# EAGLE design servo (EAGLE 6.5.0)
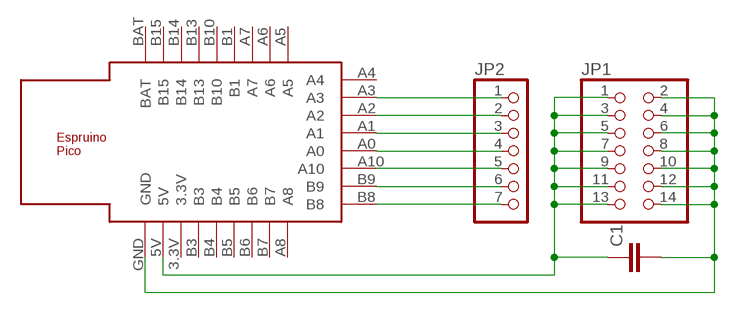
[diagram p0: schematic, sheet 1]

## Parts
C1  C-EUC1210  [C1210]
JP1  PINHD-2X7  [2X07]
JP2  PINHD-1X7  [1X07]
U$1  ESPRUINO_PICO_SMD  [ESPRUINO_PICO_SMD]

## Nets
5V: C1.1 JP1.1 JP1.3 JP1.5 JP1.7 JP1.9 JP1.11 JP1.13 U$1.5V
GND: C1.2 JP1.2 JP1.4 JP1.6 JP1.8 JP1.10 JP1.12 JP1.14 U$1.GND
N$1: JP2.1 U$1.A3
N$2: JP2.2 U$1.A2
N$3: JP2.3 U$1.A1
N$4: JP2.4 U$1.A0
N$5: JP2.5 U$1.A10
N$6: JP2.6 U$1.B9
N$9: JP2.7 U$1.B8
Unconnected: U$1.3.3V U$1.A4 U$1.A5 U$1.A6 U$1.A7 U$1.A8 U$1.B1 U$1.B3 U$1.B4 U$1.B5 U$1.B6 U$1.B7 U$1.B10 U$1.B13 U$1.B14 U$1.B15 U$1.BAT

## Library data of the parts
C1 = rcl:C-EU: CAPACITOR, European symbol
JP1 = pinhead:PINHD-2X7: PIN HEADER
JP2 = pinhead:PINHD-1X7: PIN HEADER
U$1 = espruino_pico:ESPRUINO_PICO_SMD

## Net classes
0 default: width 0.305 mm

## Board
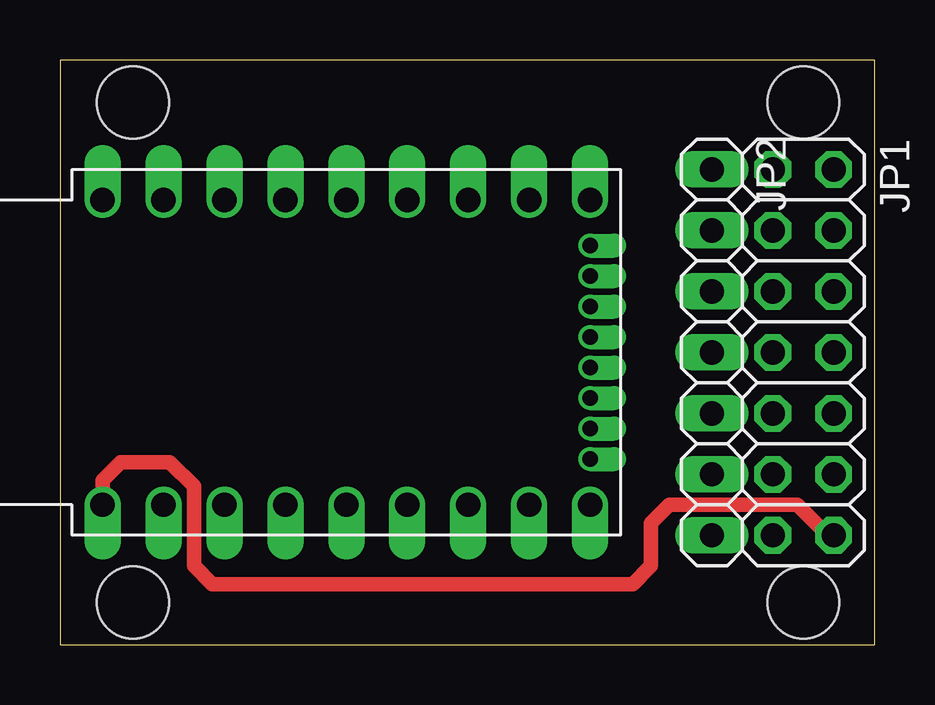
[diagram p1: board, top side]
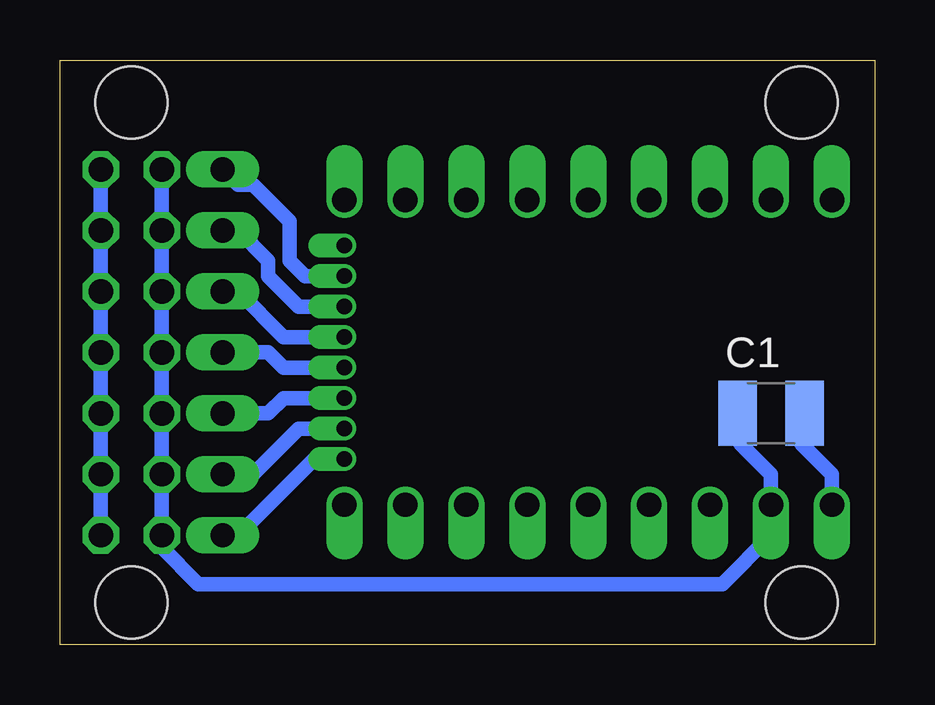
[diagram p2: board, bottom side, seen from below]

Size 33.96 x 24.37 mm. Coordinates in mm from the lower left corner, seen from the top.
Outline: 0,0 33.96,0 33.96,24.37 0,24.37 0,0
Copper layers (1*16): Top 0.0356mm / dielectric 1.5011mm / Bottom 0.0356mm
Design rules "oshpark": minimum track width 10mil, minimum drill 13mil, track to track 8mil, track to pad 6mil, pad to pad 6mil, via to via 6mil, smd to smd 6mil, copper to edge 15mil, drill to drill 6mil, minimum pad ring 7mil, minimum via ring 7mil, stop-mask expansion 4mil, vias tented up to drill 15mil, thermal gap 10mil
Holes 3 mm at 3.05,22.61 30.99,22.61 30.99,1.78 3.05,1.78

### Footprints (pad centres in the part's own frame; a part is rotated, then mirrored left to right if it is on the bottom)
C1210 = smd 1.6 x 2.7: 1 -1.4,0; 2 1.4,0
2X07 = drill 1.016 octagon: 1 -7.62,-1.27; 2 -7.62,1.27; 3 -5.08,-1.27; 4 -5.08,1.27; 5 -2.54,-1.27; 6 -2.54,1.27; 7 0,-1.27; 8 0,1.27; 9 2.54,-1.27; 10 2.54,1.27; 11 5.08,-1.27; 12 5.08,1.27; 13 7.62,-1.27; 14 7.62,1.27
1X07 = drill 1.016 long: 1 -7.62,0; 2 -5.08,0; 3 -2.54,0; 4 0,0; 5 2.54,0; 6 5.08,0; 7 7.62,0
ESPRUINO_PICO_SMD = drill 1.016 offset: 3.3V -8.89,-6.35; 5V -11.43,-6.35; A5 6.35,6.35; A6 3.81,6.35; A7 1.27,6.35; A8 6.35,-6.35; B1 -1.27,6.35; B3 -6.35,-6.35; B4 -3.81,-6.35; B5 -1.27,-6.35; B6 1.27,-6.35; B7 3.81,-6.35; B10 -3.81,6.35; B13 -6.35,6.35; B14 -8.89,6.35; B15 -11.43,6.35; BAT -13.97,6.35; GND -13.97,-6.35 | drill 0.65 pad 0.965 offset: A0 6.35,-0.635; A1 6.35,0.635; A2 6.35,1.905; A3 6.35,3.175; A4 6.35,4.445; A10 6.35,-1.905; B8 6.35,-4.445; B9 6.35,-3.175

### Placement (x,y rotation side)
C1  4.32,9.65 0 bottom
JP1  30.99,12.19 270 top
JP2  27.18,12.19 270 top
U$1  15.75,12.19 0 top

### Tracks (layer width: path | path; a pad name or v marks a point on that pad's centre or on a via)
5V
  Bottom 0.61: C1.1 5.59,9.52 5.59,8.38 4.32,7.11 U$1.5V 4.32,4.57 6.35,2.54 28.19,2.54 29.72,4.06 JP1.13 JP1.11 JP1.9 JP1.7 JP1.5 JP1.3 JP1.1
GND
  Top 0.61: JP1.14 32,4.57 30.73,5.84 25.4,5.84 24.64,5.08 24.64,3.3 23.88,2.54 6.35,2.54 5.59,3.3 5.59,6.6 4.57,7.62 2.54,7.62 1.78,6.86 U$1.GND
  Bottom 0.61: C1.2 3.05,9.52 3.05,8.38 1.78,7.11 U$1.GND 1.78,4.57 | JP1.10 JP1.12 JP1.14 JP1.2 | JP1.10 JP1.8 JP1.6 JP1.4 JP1.2 | JP1.10 JP1.2
N$1
  Bottom 0.61: JP2.1 26.54,19.18 25.91,19.18 24.38,17.65 24.38,16 23.75,15.37 U$1.A3
N$2
  Bottom 0.61: JP2.2 26.54,17.27 25.27,16 25.27,15.37 24,14.1 U$1.A2
N$3
  Bottom 0.61: JP2.3 26.54,14.73 24.64,12.83 U$1.A1
N$4
  Bottom 0.61: JP2.4 25.27,12.19 24.64,11.56 U$1.A0
N$5
  Bottom 0.61: JP2.5 25.27,9.65 24.64,10.29 U$1.A10
N$6
  Bottom 0.61: JP2.6 25.91,7.11 24,9.02 U$1.B9
N$9
  Bottom 0.61: JP2.7 26.54,4.57 23.37,7.75 U$1.B8